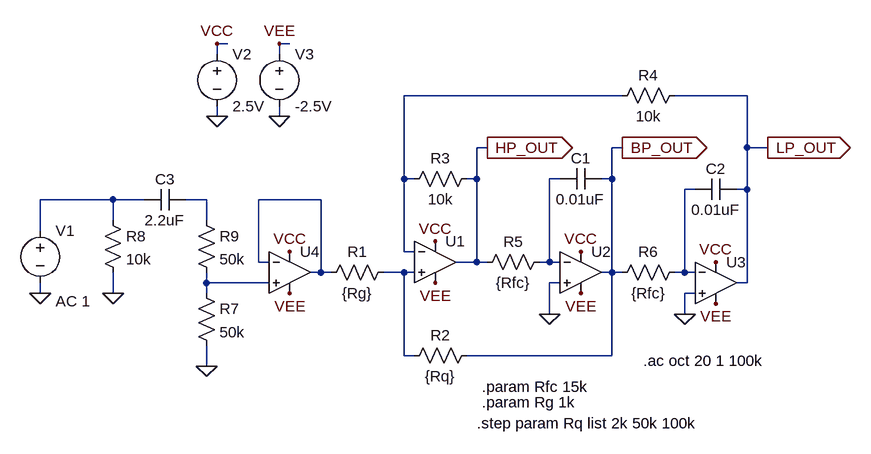
[diagram p0: schematic SVF_sim_AC_Coupling_Level.asc]
SVF_sim_AC_Coupling_Level.asc, the LTspice schematic file:
Version 4
SHEET 1 880 680
WIRE -288 -240 -304 -240
WIRE -192 -240 -208 -240
WIRE -304 -224 -304 -240
WIRE -208 -224 -208 -240
WIRE 320 -160 -16 -160
WIRE 512 -160 400 -160
WIRE -304 -128 -304 -144
WIRE -208 -128 -208 -144
WIRE 112 -80 96 -80
WIRE 320 -80 304 -80
WIRE 512 -80 512 -160
WIRE 544 -80 512 -80
WIRE -16 -32 -16 -160
WIRE 0 -32 -16 -32
WIRE 96 -32 96 -80
WIRE 96 -32 80 -32
WIRE 224 -32 208 -32
WIRE 304 -32 304 -80
WIRE 304 -32 288 -32
WIRE 432 -16 416 -16
WIRE 512 -16 512 -80
WIRE 512 -16 496 -16
WIRE -464 0 -576 0
WIRE -416 0 -464 0
WIRE -320 0 -352 0
WIRE -144 0 -240 0
WIRE -464 32 -464 0
WIRE -320 32 -320 0
WIRE -576 48 -576 0
WIRE -16 80 -16 -32
WIRE 0 80 -16 80
WIRE -240 96 -240 0
WIRE -224 96 -240 96
WIRE 96 96 96 -32
WIRE 96 96 64 96
WIRE 112 96 96 96
WIRE 208 96 208 -32
WIRE 208 96 192 96
WIRE 224 96 208 96
WIRE -144 112 -144 0
WIRE -144 112 -160 112
WIRE -128 112 -144 112
WIRE -16 112 -48 112
WIRE 0 112 -16 112
WIRE 304 112 304 -32
WIRE 304 112 288 112
WIRE 320 112 304 112
WIRE 416 112 416 -16
WIRE 416 112 400 112
WIRE 432 112 416 112
WIRE -320 128 -320 112
WIRE -224 128 -320 128
WIRE 224 128 208 128
WIRE 512 128 512 -16
WIRE 512 128 496 128
WIRE -576 144 -576 128
WIRE -464 144 -464 112
WIRE -320 144 -320 128
WIRE 432 144 416 144
WIRE 208 176 208 128
WIRE 416 176 416 144
WIRE -16 240 -16 112
WIRE 0 240 -16 240
WIRE 304 240 304 112
WIRE 304 240 80 240
WIRE -320 256 -320 224
FLAG -576 144 0
FLAG 208 176 0
FLAG 416 176 0
FLAG 32 64 VCC
FLAG 32 128 VEE
FLAG 256 144 VEE
FLAG 464 160 VEE
FLAG 256 80 VCC
FLAG 464 96 VCC
FLAG 112 -80 HP_OUT
IOPIN 112 -80 Out
FLAG 320 -80 BP_OUT
IOPIN 320 -80 Out
FLAG 544 -80 LP_OUT
IOPIN 544 -80 Out
FLAG -304 -128 0
FLAG -208 -128 0
FLAG -304 -240 VCC
FLAG -208 -240 VEE
FLAG -320 256 0
FLAG -464 144 0
FLAG -192 80 VCC
FLAG -192 144 VEE
SYMBOL Opamps\\UniversalOpamp2 32 96 R0
SYMATTR InstName U1
SYMBOL Opamps\\UniversalOpamp2 256 112 R0
SYMATTR InstName U2
SYMBOL Opamps\\UniversalOpamp2 464 128 R0
SYMATTR InstName U3
SYMBOL res -32 96 R90
WINDOW 0 0 56 VBottom 2
WINDOW 3 32 56 VTop 2
SYMATTR InstName R1
SYMATTR Value {Rg}
SYMBOL res 96 224 R90
WINDOW 0 0 56 VBottom 2
WINDOW 3 32 56 VTop 2
SYMATTR InstName R2
SYMATTR Value {Rq}
SYMBOL res 96 -48 R90
WINDOW 0 0 56 VBottom 2
WINDOW 3 32 56 VTop 2
SYMATTR InstName R3
SYMATTR Value 10k
SYMBOL res 208 80 R90
WINDOW 0 0 56 VBottom 2
WINDOW 3 32 56 VTop 2
SYMATTR InstName R5
SYMATTR Value {Rfc}
SYMBOL voltage -576 32 R0
WINDOW 123 24 124 Left 2
WINDOW 39 0 0 Left 2
SYMATTR Value2 AC 1
SYMATTR InstName V1
SYMATTR Value ""
SYMBOL cap 288 -48 R90
WINDOW 0 0 32 VBottom 2
WINDOW 3 32 32 VTop 2
SYMATTR InstName C1
SYMATTR Value 0.01uF
SYMBOL res 416 96 R90
WINDOW 0 0 56 VBottom 2
WINDOW 3 32 56 VTop 2
SYMATTR InstName R6
SYMATTR Value {Rfc}
SYMBOL cap 496 -32 R90
WINDOW 0 0 32 VBottom 2
WINDOW 3 32 32 VTop 2
SYMATTR InstName C2
SYMATTR Value 0.01uF
SYMBOL res 416 -176 R90
WINDOW 0 0 56 VBottom 2
WINDOW 3 32 56 VTop 2
SYMATTR InstName R4
SYMATTR Value 10k
SYMBOL voltage -304 -240 R0
WINDOW 123 0 0 Left 2
WINDOW 39 0 0 Left 2
SYMATTR InstName V2
SYMATTR Value 2.5V
SYMBOL voltage -208 -240 R0
WINDOW 123 0 0 Left 2
WINDOW 39 0 0 Left 2
SYMATTR InstName V3
SYMATTR Value -2.5V
SYMBOL cap -352 -16 R90
WINDOW 0 0 32 VBottom 2
WINDOW 3 32 32 VTop 2
SYMATTR InstName C3
SYMATTR Value 2.2uF
SYMBOL res -336 16 R0
SYMATTR InstName R9
SYMATTR Value 50k
SYMBOL res -336 128 R0
SYMATTR InstName R7
SYMATTR Value 50k
SYMBOL res -480 16 R0
SYMATTR InstName R8
SYMATTR Value 10k
SYMBOL Opamps\\UniversalOpamp2 -192 112 R0
SYMATTR InstName U4
TEXT 352 248 Left 2 !.ac oct 20 1 100k
TEXT 104 288 Left 2 !.param Rfc 15k
TEXT 104 312 Left 2 !.param Rg 1k
TEXT 96 344 Left 2 !.step param Rq list 2k 50k 100k

The netlist it stands for:
* SVF_sim_AC_Coupling_Level.asc
XU1 N007 N001 VCC VEE HP_OUT level.2 Avol=1Meg GBW=10Meg Slew=10Meg ilimit=25m rail=0 Vos=0 phimargin=45 en=0 enk=0 in=0 ink=0 Rin=500Meg  ; pins IN+ IN- V+ V- OUT
XU2 0 N002 VCC VEE BP_OUT level.2 Avol=1Meg GBW=10Meg Slew=10Meg ilimit=25m rail=0 Vos=0 phimargin=45 en=0 enk=0 in=0 ink=0 Rin=500Meg  ; pins IN+ IN- V+ V- OUT
XU3 0 N003 VCC VEE LP_OUT level.2 Avol=1Meg GBW=10Meg Slew=10Meg ilimit=25m rail=0 Vos=0 phimargin=45 en=0 enk=0 in=0 ink=0 Rin=500Meg  ; pins IN+ IN- V+ V- OUT
R1 N007 N006 {Rg}
R2 BP_OUT N007 {Rq}
R3 HP_OUT N001 10k
R5 N002 HP_OUT {Rfc}
V1 N004 0 AC 1
C1 BP_OUT N002 0.01uF
R6 N003 BP_OUT {Rfc}
C2 LP_OUT N003 0.01uF
R4 LP_OUT N001 10k
V2 VCC 0 2.5V
V3 VEE 0 -2.5V
C3 N005 N004 2.2uF
R9 N005 N008 50k
R7 N008 0 50k
R8 N004 0 10k
XU4 N008 N006 VCC VEE N006 level.2 Avol=1Meg GBW=10Meg Slew=10Meg ilimit=25m rail=0 Vos=0 phimargin=45 en=0 enk=0 in=0 ink=0 Rin=500Meg  ; pins IN+ IN- V+ V- OUT
.ac oct 20 1 100k
.param Rfc 15k
.param Rg 1k
.step param Rq list 2k 50k 100k
.lib UniversalOpamps2.sub
.backanno
.end